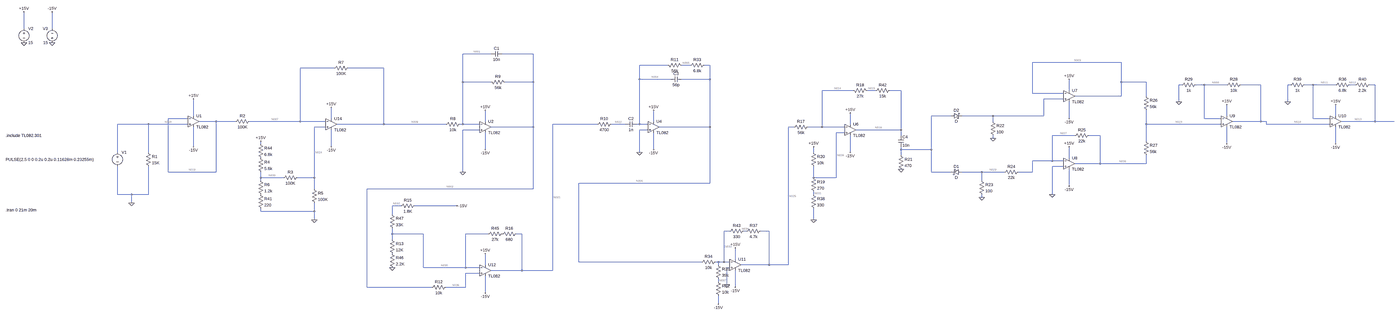
[diagram p0: schematic tp2modificado.asc, whole sheet]
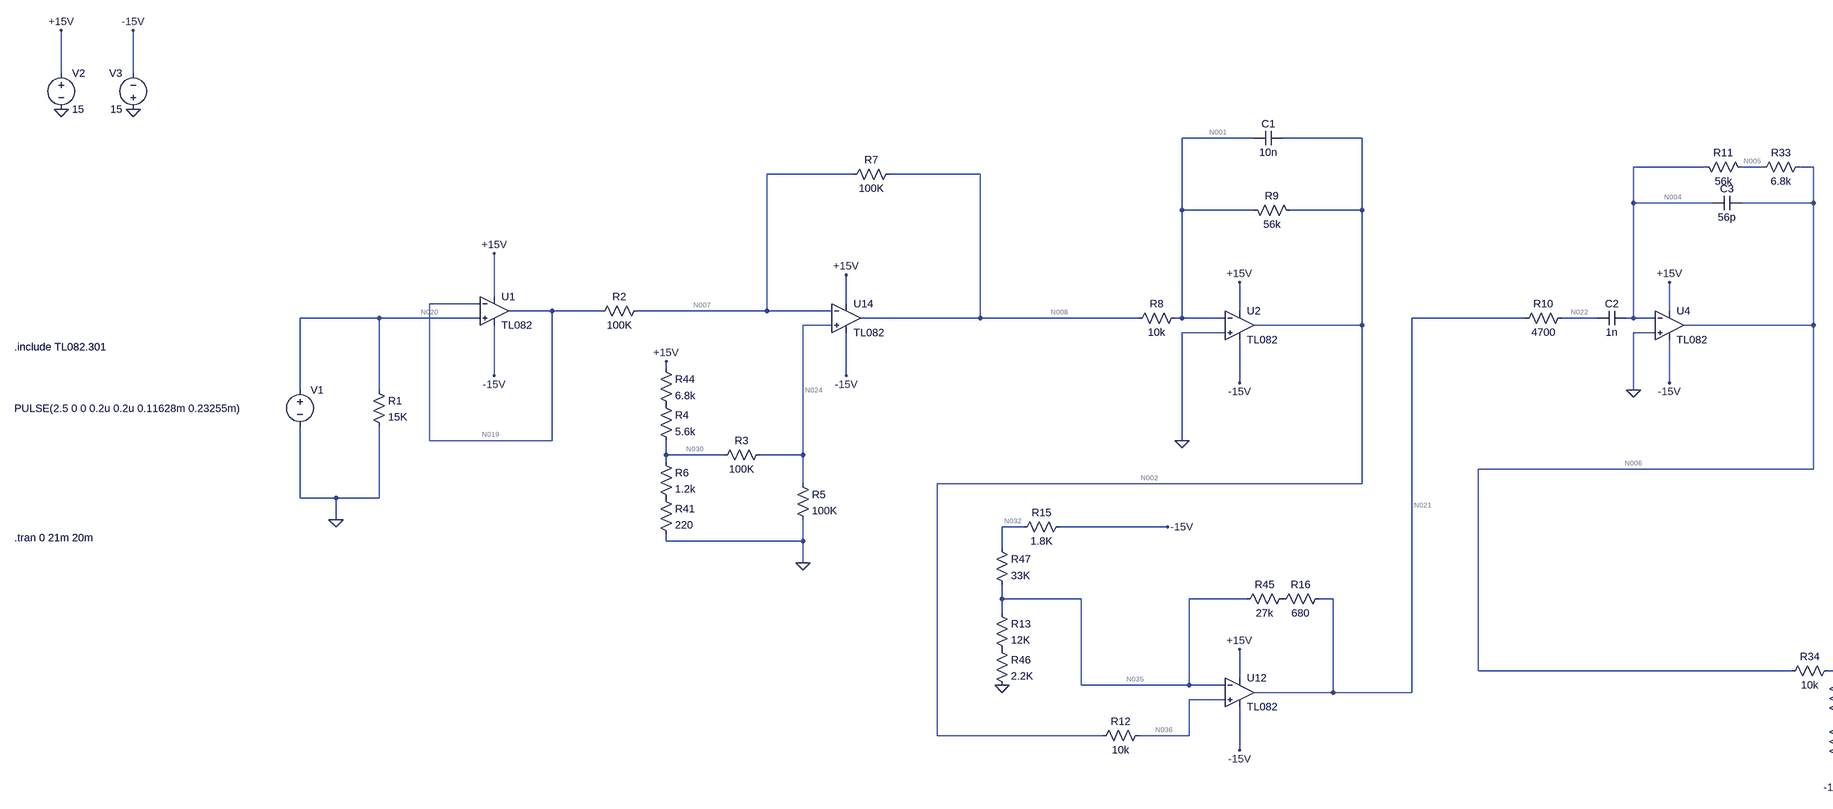
[diagram p1: schematic tp2modificado.asc, part, row 1 of 1, column 1 of 2]
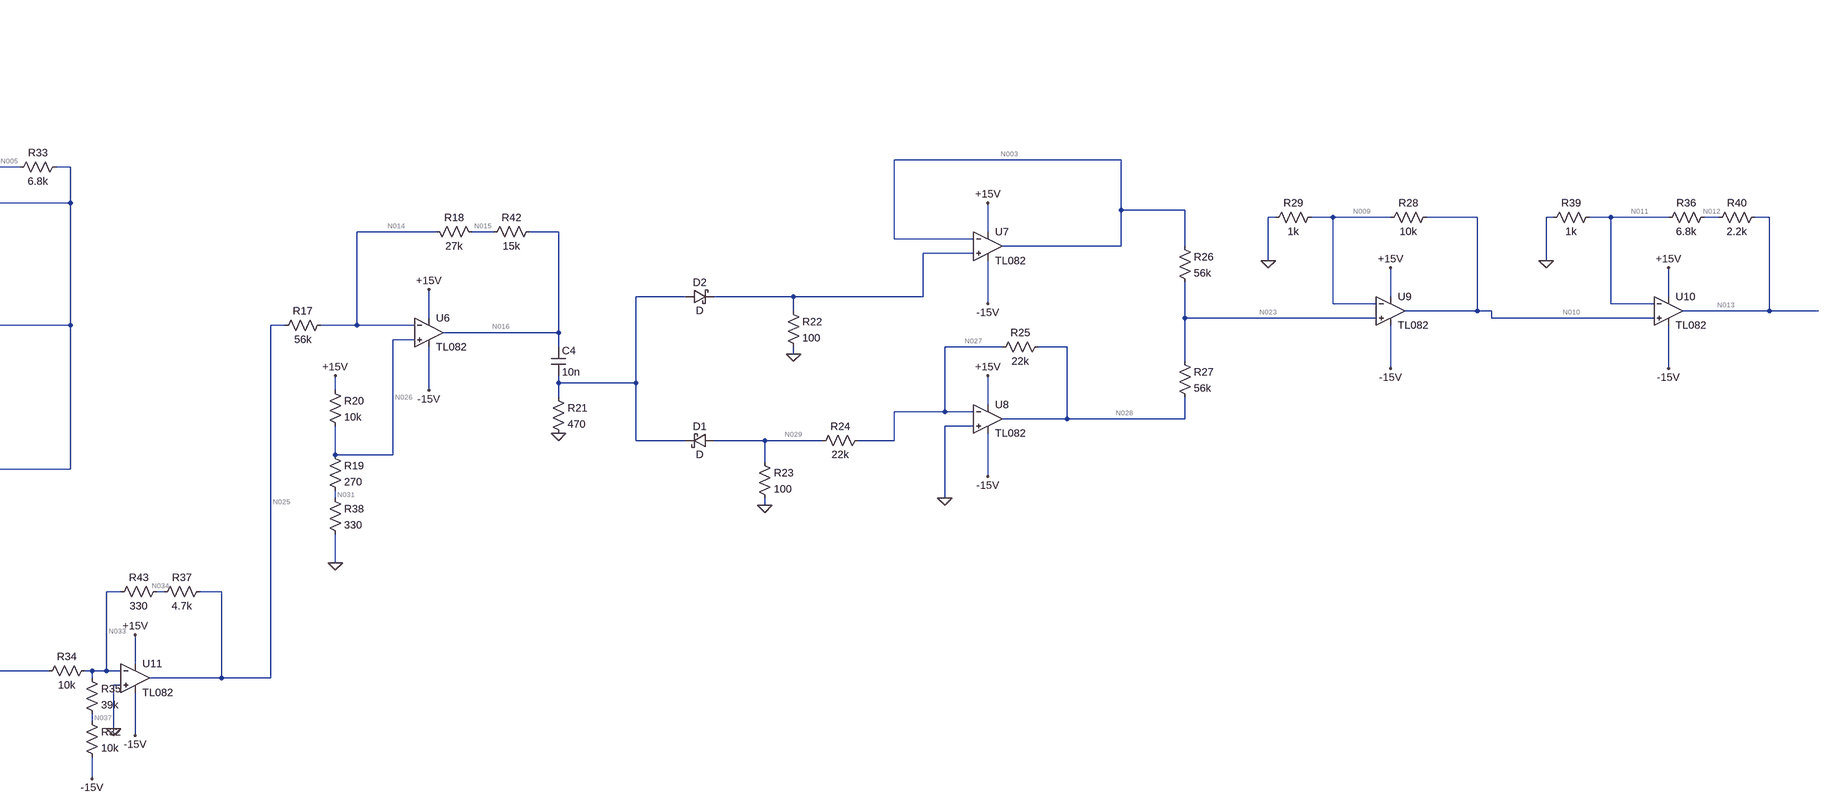
[diagram p2: schematic tp2modificado.asc, part, row 1 of 1, column 2 of 2]
tp2modificado.asc, the LTspice schematic file:
Version 4.1
SHEET 1 8932 2068
WIRE -1280 -384 -1280 -480
WIRE -1120 -384 -1120 -480
WIRE 1456 -240 1296 -240
WIRE 1696 -240 1520 -240
WIRE 5504 -192 4992 -192
WIRE 2816 -176 2656 -176
WIRE 2944 -176 2896 -176
WIRE 3056 -176 3024 -176
WIRE 544 -160 352 -160
WIRE 848 -160 624 -160
WIRE 2656 -96 2656 -176
WIRE 2832 -96 2656 -96
WIRE 3056 -96 3056 -176
WIRE 3056 -96 2896 -96
WIRE 1296 -80 1296 -240
WIRE 1456 -80 1296 -80
WIRE 1696 -80 1696 -240
WIRE 1696 -80 1536 -80
WIRE 5504 -80 5504 -192
WIRE 5648 -80 5504 -80
WIRE 5904 -64 5888 -64
WIRE 6032 -64 5984 -64
WIRE 6160 -64 6032 -64
WIRE 6384 -64 6240 -64
WIRE 6560 -64 6544 -64
WIRE 6688 -64 6640 -64
WIRE 6816 -64 6688 -64
WIRE 6928 -64 6896 -64
WIRE 7040 -64 7008 -64
WIRE 3872 -32 3696 -32
WIRE 4000 -32 3952 -32
WIRE 4144 -32 4080 -32
WIRE 5200 -32 5200 -96
WIRE 4992 -16 4992 -192
WIRE 5168 -16 4992 -16
WIRE 5504 0 5504 -80
WIRE 5504 0 5232 0
WIRE 5648 0 5648 -80
WIRE 5168 16 5056 16
WIRE 5888 32 5888 -64
WIRE 6544 32 6544 -64
WIRE -304 112 -304 16
WIRE 4528 112 4384 112
WIRE 4768 112 4592 112
WIRE 5056 112 5056 16
WIRE 5056 112 4768 112
WIRE 6160 112 6160 48
WIRE 6816 112 6816 48
WIRE -336 128 -448 128
WIRE 528 128 528 64
WIRE 5200 128 5200 32
WIRE 6032 128 6032 -64
WIRE 6128 128 6032 128
WIRE 6688 128 6688 -64
WIRE 6784 128 6688 128
WIRE -176 144 -272 144
WIRE -16 144 -176 144
WIRE 352 144 352 -160
WIRE 352 144 64 144
WIRE 496 144 352 144
WIRE 1424 144 1424 80
WIRE 2736 144 2736 80
WIRE 4768 144 4768 112
WIRE 6384 144 6384 -64
WIRE 6384 144 6192 144
WIRE 6416 144 6384 144
WIRE 7040 144 7040 -64
WIRE 7040 144 6848 144
WIRE 7168 144 7040 144
WIRE -560 160 -736 160
WIRE -336 160 -560 160
WIRE 848 160 848 -160
WIRE 848 160 560 160
WIRE 1200 160 848 160
WIRE 1296 160 1296 -80
WIRE 1296 160 1280 160
WIRE 1392 160 1296 160
WIRE 2416 160 2032 160
WIRE 2576 160 2496 160
WIRE 2656 160 2656 -96
WIRE 2656 160 2640 160
WIRE 2704 160 2656 160
WIRE 3856 160 3856 96
WIRE 5648 160 5648 80
WIRE 6128 160 5648 160
WIRE 6416 160 6416 144
WIRE 6784 160 6416 160
WIRE 496 176 432 176
WIRE 1696 176 1696 -80
WIRE 1696 176 1456 176
WIRE 3056 176 3056 -96
WIRE 3056 176 2768 176
WIRE 3536 176 3504 176
WIRE 3696 176 3696 -32
WIRE 3696 176 3616 176
WIRE 3824 176 3696 176
WIRE 1392 192 1296 192
WIRE 2704 192 2656 192
WIRE 4144 192 4144 -32
WIRE 4144 192 3888 192
WIRE 3824 208 3776 208
WIRE 4144 224 4144 192
WIRE 5232 224 5104 224
WIRE 5376 224 5312 224
WIRE 4768 240 4768 224
WIRE 5648 256 5648 160
WIRE 128 272 128 256
WIRE 6160 272 6160 176
WIRE 6816 272 6816 176
WIRE -304 288 -304 176
WIRE 528 288 528 192
WIRE 1424 304 1424 208
WIRE 2736 304 2736 208
WIRE 4144 304 4144 288
WIRE 4384 304 4384 112
WIRE 4384 304 4144 304
WIRE -736 320 -736 160
WIRE -560 320 -560 160
WIRE 2656 320 2656 192
WIRE 3648 320 3648 288
WIRE 3856 320 3856 224
WIRE 4144 336 4144 304
WIRE 5200 352 5200 288
WIRE 5104 368 5104 224
WIRE 5104 368 4992 368
WIRE 5168 368 5104 368
WIRE 5376 384 5376 224
WIRE 5376 384 5232 384
WIRE 5648 384 5648 336
WIRE 5648 384 5376 384
WIRE 5168 400 5104 400
WIRE -448 432 -448 128
WIRE -176 432 -176 144
WIRE -176 432 -448 432
WIRE 1296 432 1296 192
WIRE 4384 432 4384 304
WIRE 4528 432 4384 432
WIRE 4704 432 4592 432
WIRE 4832 432 4704 432
WIRE 4992 432 4992 368
WIRE 4992 432 4912 432
WIRE 128 464 128 432
WIRE 256 464 128 464
WIRE 432 464 432 176
WIRE 432 464 336 464
WIRE 3648 464 3648 400
WIRE 3776 464 3776 208
WIRE 3776 464 3648 464
WIRE 128 480 128 464
WIRE 4704 480 4704 432
WIRE 3056 496 3056 176
WIRE 3056 496 2256 496
WIRE 5200 512 5200 416
WIRE 432 528 432 464
WIRE 1696 528 1696 176
WIRE 1696 528 752 528
WIRE -736 560 -736 400
WIRE -656 560 -736 560
WIRE -560 560 -560 400
WIRE -560 560 -656 560
WIRE 3648 560 3648 544
WIRE 5104 560 5104 400
WIRE 4704 576 4704 560
WIRE -656 608 -656 560
WIRE 944 624 896 624
WIRE 1264 624 1024 624
WIRE 128 656 128 640
WIRE 432 656 432 608
WIRE 432 656 128 656
WIRE 896 672 896 624
WIRE 432 704 432 656
WIRE 3648 704 3648 640
WIRE 3168 768 3136 768
WIRE 3264 768 3248 768
WIRE 3392 768 3344 768
WIRE 896 784 896 752
WIRE 1072 784 896 784
WIRE 1440 784 1312 784
WIRE 1632 784 1600 784
WIRE 896 816 896 784
WIRE 3200 928 3200 864
WIRE 2256 944 2256 496
WIRE 3008 944 2256 944
WIRE 3104 944 3088 944
WIRE 3136 944 3136 768
WIRE 3136 944 3104 944
WIRE 3168 944 3136 944
WIRE 1424 960 1424 896
WIRE 3104 960 3104 944
WIRE 3392 960 3392 768
WIRE 3392 960 3232 960
WIRE 3504 960 3504 176
WIRE 3504 960 3392 960
WIRE 1072 976 1072 784
WIRE 1312 976 1312 784
WIRE 1312 976 1072 976
WIRE 1392 976 1312 976
WIRE 3168 976 3152 976
WIRE 1632 992 1632 784
WIRE 1632 992 1456 992
WIRE 2032 992 2032 160
WIRE 2032 992 1632 992
WIRE 1392 1008 1312 1008
WIRE 3104 1056 3104 1040
WIRE 3152 1072 3152 976
WIRE 752 1088 752 528
WIRE 1120 1088 752 1088
WIRE 1312 1088 1312 1008
WIRE 1312 1088 1200 1088
WIRE 3200 1088 3200 992
WIRE 1424 1120 1424 1024
WIRE 3104 1184 3104 1136
FLAG -1280 -304 0
FLAG -1120 -304 0
FLAG -1120 -480 -15V
FLAG -1280 -480 +15V
FLAG -304 16 +15V
FLAG -304 288 -15V
FLAG 528 64 +15V
FLAG 528 288 -15V
FLAG 432 704 0
FLAG 128 256 +15V
FLAG 1424 80 +15V
FLAG 1424 304 -15V
FLAG 1296 432 0
FLAG 2736 80 +15V
FLAG 2736 304 -15V
FLAG 3856 96 +15V
FLAG 3856 320 -15V
FLAG 3648 288 +15V
FLAG 3648 704 0
FLAG 4144 416 0
FLAG 4768 240 0
FLAG 4704 576 0
FLAG 5200 -96 +15V
FLAG 5200 128 -15V
FLAG 5200 288 +15V
FLAG 5200 512 -15V
FLAG 5104 560 0
FLAG 6160 48 +15V
FLAG 6160 272 -15V
FLAG 5888 32 0
FLAG 3200 864 +15V
FLAG 3200 1088 -15V
FLAG 3152 1072 0
FLAG 3104 1184 -15V
FLAG 2656 320 0
FLAG 6816 48 +15V
FLAG 6816 272 -15V
FLAG 6544 32 0
FLAG -656 608 0
FLAG 1424 896 +15V
FLAG 1424 1120 -15V
FLAG 896 976 0
FLAG 1264 624 -15V
SYMBOL voltage -736 304 R0
WINDOW 3 -648 57 Left 2
WINDOW 123 0 0 Left 0
WINDOW 39 0 0 Left 0
SYMATTR Value PULSE(2.5 0 0 0.2u 0.2u 0.11628m 0.23255m)
SYMATTR InstName V1
SYMBOL voltage -1280 -400 R0
SYMATTR InstName V2
SYMATTR Value 15
SYMBOL voltage -1120 -288 R180
WINDOW 0 24 96 Left 2
WINDOW 3 24 16 Left 2
SYMATTR InstName V3
SYMATTR Value 15
SYMBOL res -576 304 R0
SYMATTR InstName R1
SYMATTR Value 15K
SYMBOL res 80 128 R90
WINDOW 0 0 56 VBottom 2
WINDOW 3 32 56 VTop 2
SYMATTR InstName R2
SYMATTR Value 100K
SYMBOL res 352 448 R90
WINDOW 0 0 56 VBottom 2
WINDOW 3 32 56 VTop 2
SYMATTR InstName R3
SYMATTR Value 100K
SYMBOL res 112 336 R0
SYMATTR InstName R4
SYMATTR Value 5.6k
SYMBOL res 416 512 R0
SYMATTR InstName R5
SYMATTR Value 100K
SYMBOL res 112 464 R0
SYMATTR InstName R6
SYMATTR Value 1.2k
SYMBOL res 640 -176 R90
WINDOW 0 0 56 VBottom 2
WINDOW 3 32 56 VTop 2
SYMATTR InstName R7
SYMATTR Value 100K
SYMBOL res 1296 144 R90
WINDOW 0 0 56 VBottom 2
WINDOW 3 32 56 VTop 2
SYMATTR InstName R8
SYMATTR Value 10k
SYMBOL res 1440 -96 M90
WINDOW 0 0 56 VBottom 2
WINDOW 3 32 56 VTop 2
SYMATTR InstName R9
SYMATTR Value 56k
SYMBOL cap 1456 -224 R270
WINDOW 0 32 32 VTop 2
WINDOW 3 0 32 VBottom 2
SYMATTR InstName C1
SYMATTR Value 10n
SYMBOL res 2512 144 R90
WINDOW 0 0 56 VBottom 2
WINDOW 3 32 56 VTop 2
SYMATTR InstName R10
SYMATTR Value 4700
SYMBOL cap 2640 144 R90
WINDOW 0 0 32 VBottom 2
WINDOW 3 32 32 VTop 2
SYMATTR InstName C2
SYMATTR Value 1n
SYMBOL res 2800 -192 M90
WINDOW 0 0 56 VBottom 2
WINDOW 3 32 56 VTop 2
SYMATTR InstName R11
SYMATTR Value 56k
SYMBOL cap 2896 -112 R90
WINDOW 0 0 32 VBottom 2
WINDOW 3 32 32 VTop 2
SYMATTR InstName C3
SYMATTR Value 56p
SYMBOL res 3632 160 R90
WINDOW 0 0 56 VBottom 2
WINDOW 3 32 56 VTop 2
SYMATTR InstName R17
SYMATTR Value 56k
SYMBOL res 3856 -48 M90
WINDOW 0 0 56 VBottom 2
WINDOW 3 32 56 VTop 2
SYMATTR InstName R18
SYMATTR Value 27k
SYMBOL res 3632 448 R0
SYMATTR InstName R19
SYMATTR Value 270
SYMBOL res 3632 304 R0
SYMATTR InstName R20
SYMATTR Value 10k
SYMBOL cap 4128 224 R0
SYMATTR InstName C4
SYMATTR Value 10n
SYMBOL res 4128 320 R0
SYMATTR InstName R21
SYMATTR Value 470
SYMBOL schottky 4592 416 R90
WINDOW 0 0 32 VBottom 2
WINDOW 3 32 32 VTop 2
SYMATTR InstName D1
SYMBOL schottky 4528 128 R270
WINDOW 0 32 32 VTop 2
WINDOW 3 0 32 VBottom 2
SYMATTR InstName D2
SYMBOL res 4752 128 R0
SYMATTR InstName R22
SYMATTR Value 100
SYMBOL res 4688 464 R0
SYMATTR InstName R23
SYMATTR Value 100
SYMBOL res 4928 416 R90
WINDOW 0 0 56 VBottom 2
WINDOW 3 32 56 VTop 2
SYMATTR InstName R24
SYMATTR Value 22k
SYMBOL res 5328 208 R90
WINDOW 0 0 56 VBottom 2
WINDOW 3 32 56 VTop 2
SYMATTR InstName R25
SYMATTR Value 22k
SYMBOL res 5632 -16 R0
SYMATTR InstName R26
SYMATTR Value 56k
SYMBOL res 5632 240 R0
SYMATTR InstName R27
SYMATTR Value 56k
SYMBOL res 6256 -80 R90
WINDOW 0 0 56 VBottom 2
WINDOW 3 32 56 VTop 2
SYMATTR InstName R28
SYMATTR Value 10k
SYMBOL res 6000 -80 R90
WINDOW 0 0 56 VBottom 2
WINDOW 3 32 56 VTop 2
SYMATTR InstName R29
SYMATTR Value 1k
SYMBOL res 3104 928 R90
WINDOW 0 0 56 VBottom 2
WINDOW 3 32 56 VTop 2
SYMATTR InstName R34
SYMATTR Value 10k
SYMBOL res 3088 944 R0
SYMATTR InstName R35
SYMATTR Value 39k
SYMBOL res 3360 752 R90
WINDOW 0 0 56 VBottom 2
WINDOW 3 32 56 VTop 2
SYMATTR InstName R37
SYMATTR Value 4.7k
SYMBOL res 6912 -80 R90
WINDOW 0 0 56 VBottom 2
WINDOW 3 32 56 VTop 2
SYMATTR InstName R36
SYMATTR Value 6.8k
SYMBOL res 6656 -80 R90
WINDOW 0 0 56 VBottom 2
WINDOW 3 32 56 VTop 2
SYMATTR InstName R39
SYMATTR Value 1k
SYMBOL res 112 544 R0
SYMATTR InstName R41
SYMATTR Value 220
SYMBOL OpAmps\\opamp2 528 96 R0
SYMATTR InstName U14
SYMATTR Value TL082
SYMBOL OpAmps\\opamp2 -304 80 R0
SYMATTR InstName U1
SYMATTR Value TL082
SYMBOL OpAmps\\opamp2 1424 112 R0
SYMATTR InstName U2
SYMATTR Value TL082
SYMBOL OpAmps\\opamp2 2736 112 R0
SYMATTR InstName U4
SYMATTR Value TL082
SYMBOL OpAmps\\opamp2 3200 896 R0
SYMATTR InstName U11
SYMATTR Value TL082
SYMBOL OpAmps\\opamp2 3856 128 R0
SYMATTR InstName U6
SYMATTR Value TL082
SYMBOL OpAmps\\opamp2 5200 -64 R0
SYMATTR InstName U7
SYMATTR Value TL082
SYMBOL OpAmps\\opamp2 5200 320 R0
SYMATTR InstName U8
SYMATTR Value TL082
SYMBOL OpAmps\\opamp2 6160 80 R0
SYMATTR InstName U9
SYMATTR Value TL082
SYMBOL res 3088 1040 R0
SYMATTR InstName R32
SYMATTR Value 10k
SYMBOL OpAmps\\opamp2 6816 80 R0
SYMATTR InstName U10
SYMATTR Value TL082
SYMBOL res 3040 -192 R90
WINDOW 0 0 56 VBottom 2
WINDOW 3 32 56 VTop 2
SYMATTR InstName R33
SYMATTR Value 6.8k
SYMBOL res 3632 544 R0
SYMATTR InstName R38
SYMATTR Value 330
SYMBOL res 7024 -80 R90
WINDOW 0 0 56 VBottom 2
WINDOW 3 32 56 VTop 2
SYMATTR InstName R40
SYMATTR Value 2.2k
SYMBOL res 4096 -48 R90
WINDOW 0 0 56 VBottom 2
WINDOW 3 32 56 VTop 2
SYMATTR InstName R42
SYMATTR Value 15k
SYMBOL res 3264 752 R90
WINDOW 0 0 56 VBottom 2
WINDOW 3 32 56 VTop 2
SYMATTR InstName R43
SYMATTR Value 330
SYMBOL res 112 256 R0
SYMATTR InstName R44
SYMATTR Value 6.8k
SYMBOL res 1536 768 R90
WINDOW 0 0 56 VBottom 2
WINDOW 3 32 56 VTop 2
SYMATTR InstName R45
SYMATTR Value 27k
SYMBOL OpAmps\\opamp2 1424 928 R0
SYMATTR InstName U12
SYMATTR Value TL082
SYMBOL res 880 880 R0
SYMATTR InstName R46
SYMATTR Value 2.2K
SYMBOL res 880 656 R0
SYMATTR InstName R47
SYMATTR Value 33K
SYMBOL res 1216 1072 R90
WINDOW 0 0 56 VBottom 2
WINDOW 3 32 56 VTop 2
SYMATTR InstName R12
SYMATTR Value 10k
SYMBOL res 880 800 R0
SYMATTR InstName R13
SYMATTR Value 12K
SYMBOL res 1040 608 R90
WINDOW 0 0 56 VBottom 2
WINDOW 3 32 56 VTop 2
SYMATTR InstName R15
SYMATTR Value 1.8K
SYMBOL res 1616 768 R90
WINDOW 0 0 56 VBottom 2
WINDOW 3 32 56 VTop 2
SYMATTR InstName R16
SYMATTR Value 680
TEXT -1384 648 Left 2 !.tran 0 21m 20m
TEXT -1384 224 Left 2 !.include TL082.301

The netlist it stands for:
* tp2modificado.asc
V1 N020 0 PULSE(2.5 0 0 0.2u 0.2u 0.11628m 0.23255m)
V2 +15V 0 15
V3 0 -15V 15
R1 N020 0 15K
R2 N007 N019 100K
R3 N024 N030 100K
R4 P001 N030 5.6k
R5 N024 0 100K
R6 N030 P002 1.2k
R7 N008 N007 100K
R8 N001 N008 10k
R9 N001 N002 56k
C1 N001 N002 10n
R10 N022 N021 4700
C2 N004 N022 1n
R11 N004 N005 56k
C3 N006 N004 56p
R17 N014 N025 56k
R18 N014 N015 27k
R19 N026 N031 270
R20 +15V N026 10k
C4 N016 N018 10n
R21 N018 0 470
D1 N029 N018 D
D2 N018 N017 D
R22 N017 0 100
R23 N029 0 100
R24 N027 N029 22k
R25 N028 N027 22k
R26 N003 N023 56k
R27 N023 N028 56k
R28 N010 N009 10k
R29 N009 0 1k
R34 N033 N006 10k
R35 N033 N037 39k
R37 N025 N034 4.7k
R36 N012 N011 6.8k
R39 N011 0 1k
R41 P002 0 220
X§U14 N024 N007 +15V -15V N008 TL082  ; pins In+ In- V+ V- OUT
X§U1 N020 N019 +15V -15V N019 TL082  ; pins In+ In- V+ V- OUT
X§U2 0 N001 +15V -15V N002 TL082  ; pins In+ In- V+ V- OUT
X§U4 0 N004 +15V -15V N006 TL082  ; pins In+ In- V+ V- OUT
X§U11 0 N033 +15V -15V N025 TL082  ; pins In+ In- V+ V- OUT
X§U6 N026 N014 +15V -15V N016 TL082  ; pins In+ In- V+ V- OUT
X§U7 N017 N003 +15V -15V N003 TL082  ; pins In+ In- V+ V- OUT
X§U8 0 N027 +15V -15V N028 TL082  ; pins In+ In- V+ V- OUT
X§U9 N023 N009 +15V -15V N010 TL082  ; pins In+ In- V+ V- OUT
R32 N037 -15V 10k
X§U10 N010 N011 +15V -15V N013 TL082  ; pins In+ In- V+ V- OUT
R33 N006 N005 6.8k
R38 N031 0 330
R40 N013 N012 2.2k
R42 N016 N015 15k
R43 N034 N033 330
R44 +15V P001 6.8k
R45 P003 N035 27k
X§U12 N036 N035 +15V -15V N021 TL082  ; pins In+ In- V+ V- OUT
R46 P004 0 2.2K
R47 N032 N035 33K
R12 N036 N002 10k
R13 N035 P004 12K
R15 -15V N032 1.8K
R16 N021 P003 680
.model D D
.lib standard.dio
.tran 0 21m 20m
.include TL082.301
.backanno
.end

* Results of the author's LTspice run, read from the files saved beside the schematic
* Operating Point, zero values left out:
*   V(+15v) = 15 V
*   V(n019) = 2.5 V
*   V(n008) = -968.5 mV
*   V(n022) = 13.48 V
*   V(n014) = 849 mV
*   V(n016) = 331 mV
*   V(n010) = 293.4 µV
*   V(n037) = -11.94 V
*   V(n012) = 2.374 mV
*   V(p003) = 13.16 V
*   V(n007) = 765.7 mV
*   V(n030) = 1.531 V
*   V(n002) = 5.423 V
*   V(n004) = 10.97 µV
*   V(n015) = 516 mV
*   V(n029) = 49.64 nV
*   V(n028) = 22.88 µV
*   V(n033) = 3.841 µV
*   V(n013) = 3.044 mV
*   V(n036) = 5.423 V
*   V(n023) = 15.66 µV
*   V(n020) = 2.5 V
*   V(n024) = 765.7 mV
*   V(p002) = 237.3 mV
*   V(n021) = 13.48 V
*   V(n006) = 13.8 µV
*   V(n025) = 1.54 V
*   V(n031) = 467 mV
*   V(n027) = 10.97 µV
*   V(n034) = 101 mV
*   V(n035) = 412.7 mV
*   V(n032) = -14.2 V
*   V(n003) = 10.97 µV
*   V(-15v) = -15 V
*   V(p001) = 7.614 V
*   V(n001) = -12.79 µV
*   V(n005) = 13.49 µV
*   V(n026) = 849.1 mV
*   V(n009) = 26.63 µV
*   V(n011) = 304.3 µV
*   V(p004) = 63.95 mV
*   I(R23) = 496.4 pA
*   I(R18) = 12.33 µA
*   I(R3) = -7.657 µA
*   I(R47) = -442.9 µA
*   I(V1) = -166.7 µA
*   I(R40) = 304.4 nA
*   I(R35) = 306.1 µA
*   I(R8) = 96.84 µA
*   I(R28) = 26.68 nA
*   I(V3) = -156.9 mA
*   I(R36) = 304.4 nA
*   I(R43) = 306.1 µA
*   I(R11) = -45.05 pA
*   I(R5) = 7.657 µA
*   I(R20) = 1.415 mA
*   I(R13) = 29.07 µA
*   I(R25) = 541.5 pA
*   I(R2) = -17.34 µA
*   I(R38) = 1.415 mA
*   I(R45) = 472 µA
*   I(R46) = 29.07 µA
*   I(R41) = 1.079 mA
*   I(R22) = -45.05 pA
*   I(R34) = -995.9 pA
*   I(R16) = 472 µA
*   I(R7) = -17.34 µA
*   I(R27) = -128.9 pA
*   I(V2) = -158.5 mA
*   I(R17) = -12.33 µA
*   I(R42) = -12.33 µA
*   I(R12) = -55.58 pA
*   I(R24) = 496.4 pA
*   I(R37) = 306.1 µA
*   I(R4) = 1.086 mA
*   I(R19) = 1.415 mA
*   I(R15) = -442.9 µA
*   I(R39) = 304.3 nA
*   I(R44) = 1.086 mA
*   I(R9) = -96.84 µA
*   I(R1) = 166.7 µA
*   I(R29) = 26.63 nA
*   I(R33) = 45.05 pA
*   I(R32) = 306.1 µA
*   I(R26) = -83.87 pA
*   I(R6) = 1.079 mA
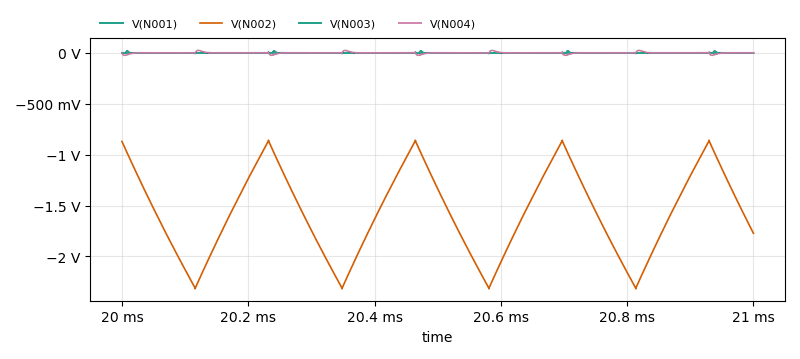
[diagram p3: Transient Analysis of tp2modificado.asc, plotted from the saved traces]
* Transient Analysis, 1 run:
*   V(N001): min -7.253 mV, max 7.287 mV, average 59.52 µV, rms 640.5 µV, last 579.6 µV
*   V(N002): min -2.319 V, max -858.6 mV, average -1.571 V, rms 1.626 V, last -1.773 V
*   V(N003): min 10.58 µV, max 19.51 mV, average 383 µV, rms 2.284 mV, last 10.96 µV
*   V(N004): min -24.43 mV, max 24.46 mV, average -252.1 µV, rms 6.483 mV, last 241 µV